# EAGLE design daugher (EAGLE 6.6.0)
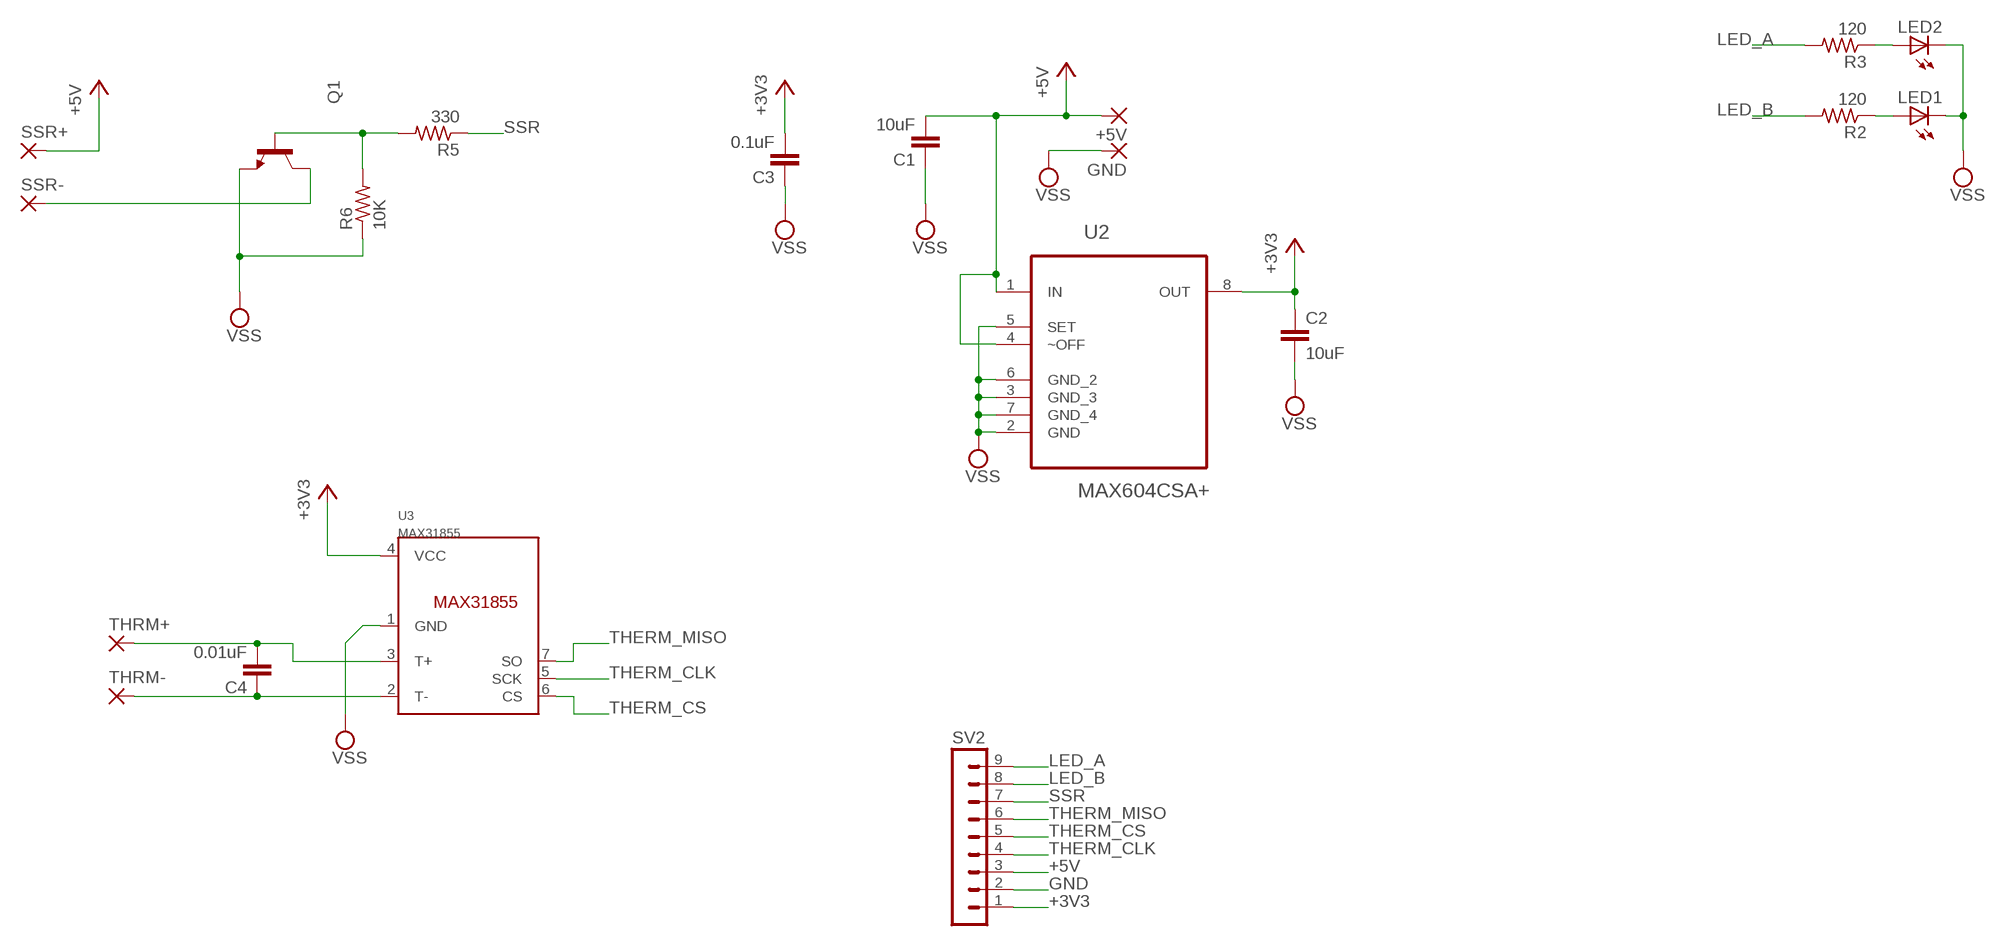
[diagram p0: schematic, sheet 1]

## Parts
+5V  1,6/0,8  [1,6/0,8]
C1  10uF  C-EUC0603  [C0603]
C2  10uF  C-EUC0603  [C0603]
C3  0.1uF  C-EUC0603  [C0603]
C4  0.01uF  C-EUC0603  [C0603]
GND  1,6/0,8  [1,6/0,8]
LED1  LEDCHIP-LED0805  [CHIP-LED0805]
LED2  LEDCHIP-LED0805  [CHIP-LED0805]
Q1  BC849SMD  [SOT23-BEC]
R2  120  R-US_R0603  [R0603]
R3  120  R-US_R0603  [R0603]
R5  330  R-US_R0603  [R0603]
R6  10K  R-US_R0603  [R0603]
SSR+  1,6/0,8  [1,6/0,8]
SSR-  1,6/0,8  [1,6/0,8]
SV2  MA09-1  [MA09-1]
THRM+  1,6/0,8  [1,6/0,8]
THRM-  1,6/0,8  [1,6/0,8]
U2  MAX604CSA+  [SOIC127P600X175-8N]
U3  MAX31855  [SOIC8]

## Nets
+3V3: C2.1 C3.2 SV2.1 U2.8(OUT) U3.4(VCC)
+5V: +5V.1(P) C1.2 SSR+.1(P) SV2.3 U2.1(IN) U2.4(~OFF)
GND: C1.1 C3.1 GND.1(P) LED1.C LED2.C Q1.E R6.1 SV2.2 U2.2(GND) U2.3(GND_3) U2.5(SET) U2.6(GND_2) U2.7(GND_4) U3.1(GND) ; supply symbol labelled VSS
GND1: Q1.C SSR-.1(P)
LED_A: R3.2 SV2.9
LED_B: R2.2 SV2.8
N$1: C4.1 THRM-.1(P) U3.2(T-)
N$2: C4.2 THRM+.1(P) U3.3(T+)
N$12: LED1.A R2.1
N$13: LED2.A R3.1
N$16: Q1.B R5.2 R6.2
SSR: R5.1 SV2.7
THERM_CLK: SV2.4 U3.5(SCK)
THERM_CS: SV2.5 U3.6(CS)
THERM_MISO: SV2.6 U3.7(SO)
VSS: C2.2

## Library data of the parts
+5V GND SSR+ SSR- THRM+ THRM- = wirepad:1,6/0,8: THROUGH-HOLE PAD
C1-C4 = resistor:C-EU: CAPACITOR, European symbol
LED1 LED2 = led:LED: LED OSRAM: - CHIPLED LG R971, LG N971, LY N971, LG Q971, LY Q971, LO R971, LY R971 LH N974, LH R974 LS Q976, LO Q976, LY Q976 LO Q996 - Hyper CHIPLED LW Q18S LB Q993, LB Q99A, LB R99A - SideLED LS A670, LO A670, LY A670, LG A670, LP A670 LB A673, LV A673, LT A673, LW A673 LH A674 LY A675 LS A676, LA A676, LO A676, LY A676, LW A676 LS A679, LY A679, LG A679 - Hyper Micro SIDELED® LS Y876, LA Y876, LO Y876, LY Y876 LT Y87S - SmartLED LW L88C, LW L88S LB L89C, LB L89S, LG L890 LS L89K, LO L89K, LY L89K LS L896, LA L896, LO L896, LY L896 - TOPLED LS T670, LO T670, LY T670, LG T670, LP T670 LSG T670, LSP T670, LSY T670, LOP T670, LYG T670 LG T671, LOG T671, LSG T671 LB T673, LV T673, LT T673, LW T673 LH T674 LS T676, LA T676, LO T676, LY T676, LB T676, LH T676, LSB T676, LW T676 LB T67C, LV T67C, LT T67C, LS T67K, LO T67K, LY T67K, LW E67C LS E67B, LA E67B, LO E67B, LY E67B, LB E67C, LV E67C, LT E67C LW T67C LS T679, LY T679, LG T679 LS T770, LO T770, LY T770, LG T770, LP T770 LB T773, LV T773, LT T773, LW T773 LH T774 LS E675, LA E675, LY E675, LS T675 LS T776, LA T776, LO T776, LY T776, LB T776 LHGB T686 LT T68C, LB T68C - Hyper Mini TOPLED® LB M676 - Mini TOPLED Santana® LG M470 LS M47K, LO M47K, LY M47K Source: http://www.osram.convergy.de LUXEON: - LUMILED® LXK2-PW12-R00, LXK2-PW12-S00, LXK2-PW14-U00, LXK2-PW14-V00 LXK2-PM12-R00, LXK2-PM12-S00, LXK2-PM14-U00 LXK2-PE12-Q00, LXK2-PE12-R00, LXK2-PE12-S00, LXK2-PE14-T00, LXK2-PE14-U00 LXK2-PB12-K00, LXK2-PB12-L00, LXK2-PB12-M00, LXK2-PB14-N00, LXK2-PB14-P00, LXK2-PB14-Q00 LXK2-PR12-L00, LXK2-PR12-M00, LXK2-PR14-Q00, LXK2-PR14-R00 LXK2-PD12-Q00, LXK2-PD12-R00, LXK2-PD12-S00 LXK2-PH12-R00, LXK2-PH12-S00 LXK2-PL12-P00, LXK2-PL12-Q00, LXK2-PL12-R00 Source: www.luxeon.com KINGBRIGHT: KA-3528ASYC Source: www.kingbright.com
Q1 = transistor-npn:BC849*: NPN Transistor
R2 R3 R5 R6 = resistor:R-US_: RESISTOR, American symbol
SV2 = con-lstb:MA09-1: PIN HEADER; OC_FARNELL: unknown; OC_NEWARK: unknown
U2 = Maxim_By_element14_Batch_1:MAX604CSA+: 5V/3.3V or Adjustable, Low-Dropout, Low IQ, 500mA Linear Regulators; MPN: MAX604CSA+; OC_FARNELL: 1187941; OC_NEWARK: 53K7108; PACKAGE: SOIC-8; SUPPLIER: Maxim
U3 = AlexW-Eagle-Libraries:MAX31855

## Board
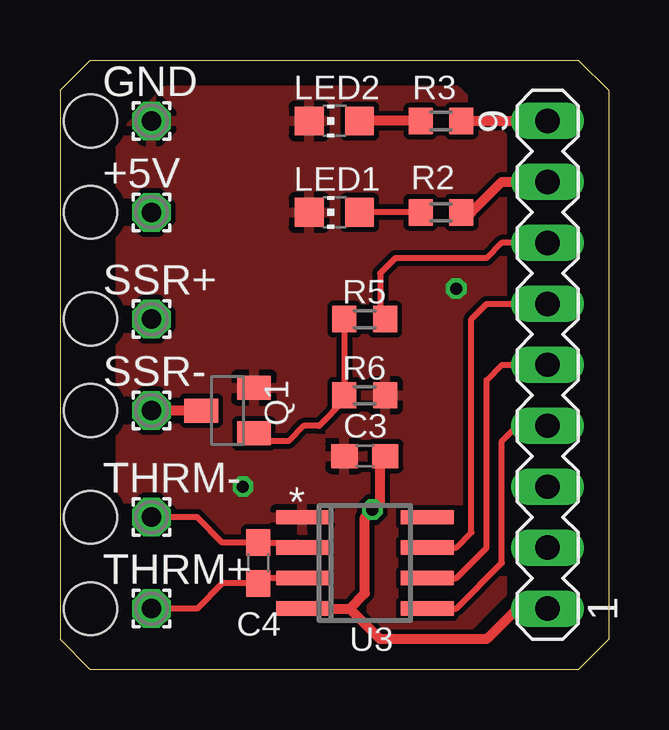
[diagram p1: board, top side]
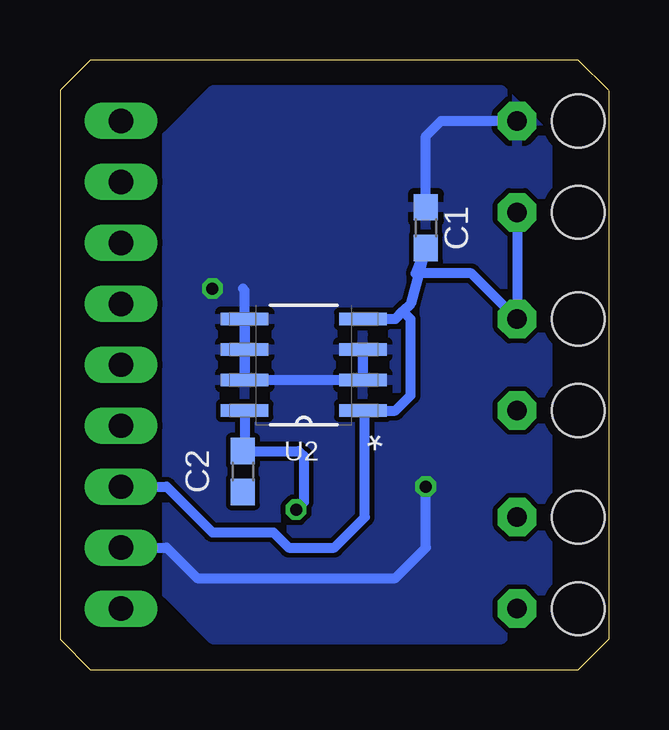
[diagram p2: board, bottom side, seen from below]

Size 22.86 x 25.4 mm. Coordinates in mm from the lower left corner, seen from the top.
Outline: 0,24.12 0,1.27 1.27,0 21.59,0 22.86,1.27 22.86,24.13 21.59,25.4 1.27,25.4 0,24.13
Copper layers (1*16): Top 0.0356mm / dielectric 1.5011mm / Bottom 0.0356mm
Design rules "LaenPCBOrder *": minimum track width 6mil, minimum drill 13mil, track to track 8mil, track to pad 8mil, pad to pad 8mil, via to via 8mil, smd to smd 6mil, copper to edge 15mil, drill to drill 6mil, minimum pad ring 7mil, minimum via ring 7mil, stop-mask expansion 4mil, vias tented up to drill 20mil, thermal gap 10mil
Holes 2.2 mm at 1.27,22.86 1.27,19.05 1.27,10.79 1.27,14.61 1.27,6.35 1.27,2.54

### Footprints (pad centres in the part's own frame; a part is rotated, then mirrored left to right if it is on the bottom)
1,6/0,8 = drill 0.813 pad 1.6 octagon: 1 0,0
C0603 = smd 1.1 x 1: 1 -0.85,0; 2 0.85,0
CHIP-LED0805 = smd 1.2 x 1.2: A 0,-1.05; C 0,1.05
SOT23-BEC = smd 1 x 1.4: B -0.95,-1.1; C 0,1.1; E 0.95,-1.1
R0603 = smd 1 x 1.1: 1 -0.85,0; 2 0.85,0
MA09-1 = drill 1.016 long: 1 -10.16,0; 2 -7.62,0; 3 -5.08,0; 4 -2.54,0; 5 0,0; 6 2.54,0; 7 5.08,0; 8 7.62,0; 9 10.16,0
SOIC127P600X175-8N = smd 1.981 x 0.533: 1 -2.464,1.905; 2 -2.464,0.635; 3 -2.464,-0.635; 4 -2.464,-1.905; 5 2.464,-1.905; 6 2.464,-0.635; 7 2.464,0.635; 8 2.464,1.905
SOIC8 = smd 0.6 x 2.2: 1 -1.905,-2.6; 2 -0.635,-2.6; 3 0.635,-2.6; 4 1.905,-2.6; 5 1.905,2.6; 6 0.635,2.6; 7 -0.635,2.6; 8 -1.905,2.6

### Placement (x,y rotation side)
+5V  3.81,19.05 0 top
C1  7.62,18.41 270 bottom
C2  15.24,8.26 270 bottom
C3  12.7,8.89 0 top
C4  8.26,4.45 270 top
GND  3.81,22.86 0 top
LED1  11.43,19.05 90 top
LED2  11.43,22.86 90 top
Q1  6.99,10.79 90 top
R2  15.88,19.05 0 top
R3  15.88,22.86 0 top
R5  12.7,14.61 180 top
R6  12.7,11.43 180 top
SSR+  3.81,14.61 0 top
SSR-  3.81,10.79 0 top
SV2  20.32,12.7 90 top
THRM+  3.81,2.54 0 top
THRM-  3.81,6.35 0 top
U2  12.7,12.7 180 bottom
U3  12.7,4.45 270 top

### Tracks (layer width: path | path; a pad name or v marks a point on that pad's centre or on a via)
+3V3  (via drill 0.5)
  Top 0.406: U3.4 12.07,2.54 | 12.07,2.54 12.7,3.17 12.7,6.35 v13.02,6.67 13.34,6.99 13.34,8.68 C3.2 | SV2.1 19.05,2.54 17.78,1.27 13.34,1.27 12.07,2.54
  Bottom 0.406: U2.8 15.16,9.18 C2.1 12.92,9.11 12.7,8.89 12.7,6.99 v13.02,6.67
+5V
  Bottom 0.406: +5V.1 SSR+.1 5.71,16.51 8.04,16.51 C1.2 8.26,15.24 8.57,14.92 | 8.57,14.92 8.89,14.61 U2.4 | SV2.3 18.41,7.62 16.51,5.71 13.97,5.71 13.34,5.08 11.43,5.08 10.16,6.35 10.16,10.72 U2.1 8.89,10.79 8.26,11.43 8.26,14.61 8.57,14.92
GND  (via drill 0.5)
  Bottom 0.406: SV2.2 18.41,5.08 17.14,3.81 8.89,3.81 7.62,5.08 v7.62,7.62 | U2.3 U2.2 U2.7 | U2.5 U2.6 U2.7 | U2.7 15.16,15.8 15.24,15.88 | C1.1 7.62,22.23 6.99,22.86 GND.1
  other vias: 16.51,15.88
  pour Bottom: 5.08,24.13 16.51,24.13 18.41,22.23 18.41,3.17 16.51,1.27 4.45,1.27 2.54,3.17 2.54,22.23 4.45,24.13
  pour Top: 4.45,24.13 16.51,24.13 18.41,22.23 18.41,3.17 16.51,1.27 4.45,1.27 2.54,3.17 2.54,22.23
GND1
  Top 0.406: Q1.C SSR-.1
LED_A
  Top 0.406: R3.2 SV2.9
LED_B
  Top 0.406: R2.2 17.14,19.05 18.41,20.32 SV2.8
N$1
  Top 0.254: U3.2 9.88,5.29 C4.1 6.77,5.29 5.71,6.35 THRM-.1
N$2
  Top 0.254: U3.3 8.47,3.81 C4.2 6.77,3.6 5.71,2.54 THRM+.1
N$12
  Top 0.254: R2.1 LED1.A
N$13
  Top 0.406: R3.1 LED2.A
N$16
  Top 0.254: R5.2 R6.2 11.85,11.21 10.79,10.16 10.16,10.16 9.53,9.53 8.41,9.53 Q1.B
SSR
  Top 0.254: SV2.7 18.41,17.78 17.78,17.14 13.97,17.14 13.34,16.51 13.34,14.82 R5.1
THERM_CLK
  Top 0.254: U3.5 16.51,2.54 18.41,4.45 18.41,9.53 19.05,10.16 SV2.4
  Top 0.406: U3.5 15.24,2.54
THERM_CS
  Top 0.254: U3.6 16.51,3.81 17.78,5.08 17.78,12.06 18.41,12.7 SV2.5
THERM_MISO
  Top 0.254: U3.7 16.51,5.08 17.14,5.71 17.14,14.61 17.78,15.24 SV2.6

### Text on the board
tNames: *